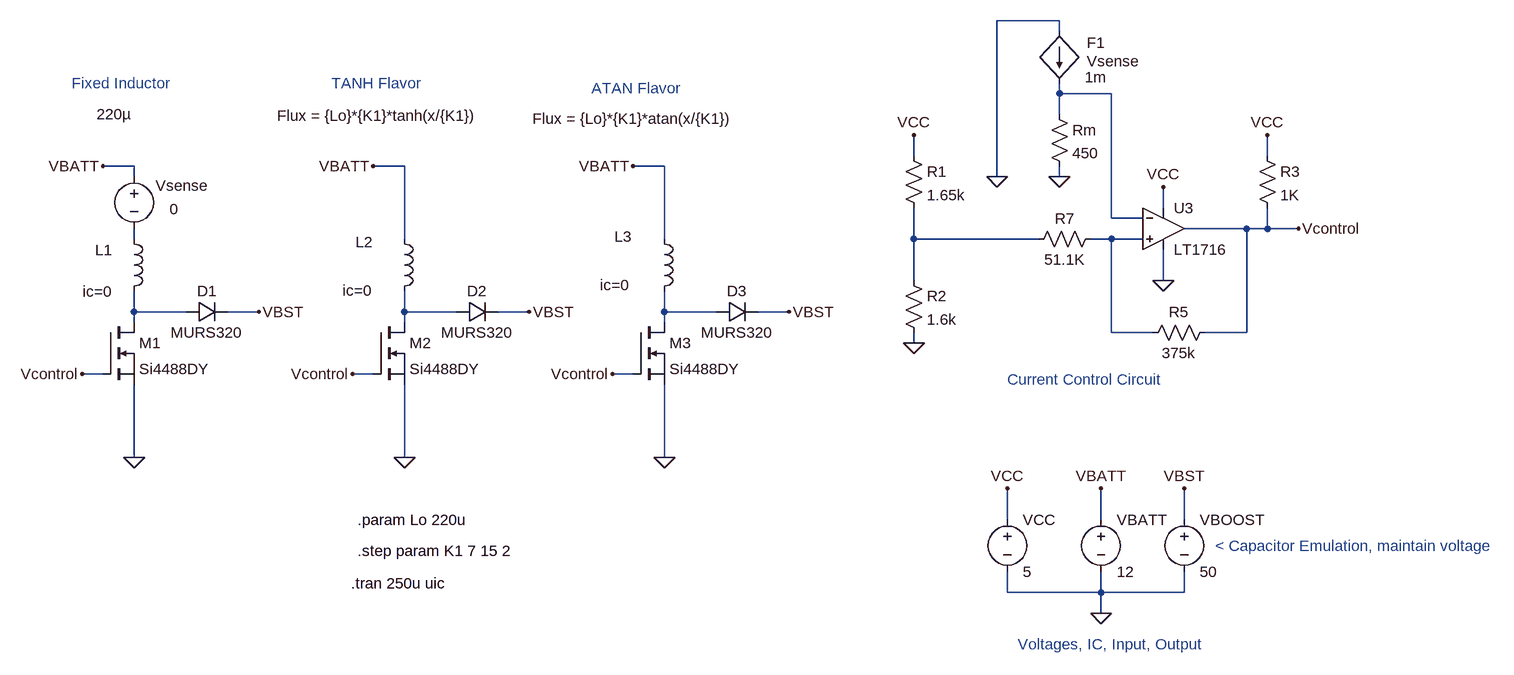
[diagram p0: schematic Nonlinear_L_experiment.asc]
Nonlinear_L_experiment.asc, the LTspice schematic file:
Version 4
SHEET 1 1996 852
WIRE -288 160 -320 160
WIRE -240 -160 -288 -160
WIRE -240 -144 -240 -160
WIRE -240 -48 -240 -64
WIRE -240 64 -240 32
WIRE -240 80 -240 64
WIRE -240 288 -240 176
WIRE -160 64 -240 64
WIRE -48 64 -96 64
WIRE 128 160 96 160
WIRE 176 -160 128 -160
WIRE 176 -48 176 -160
WIRE 176 64 176 32
WIRE 176 80 176 64
WIRE 176 288 176 176
WIRE 256 64 176 64
WIRE 368 64 320 64
WIRE 528 160 496 160
WIRE 576 -160 528 -160
WIRE 576 -48 576 -160
WIRE 576 64 576 32
WIRE 576 80 576 64
WIRE 576 288 576 176
WIRE 656 64 576 64
WIRE 768 64 720 64
WIRE 960 -176 960 -208
WIRE 960 -48 960 -96
WIRE 960 16 960 -48
WIRE 960 112 960 96
WIRE 1088 -144 1088 -384
WIRE 1104 384 1104 336
WIRE 1104 496 1104 464
WIRE 1152 -48 960 -48
WIRE 1184 -384 1088 -384
WIRE 1184 -368 1184 -384
WIRE 1184 -272 1184 -288
WIRE 1184 -240 1184 -272
WIRE 1184 -144 1184 -160
WIRE 1248 384 1248 336
WIRE 1248 496 1104 496
WIRE 1248 496 1248 464
WIRE 1248 528 1248 496
WIRE 1264 -272 1184 -272
WIRE 1264 -80 1264 -272
WIRE 1264 -48 1232 -48
WIRE 1264 96 1264 -48
WIRE 1312 -80 1264 -80
WIRE 1312 -48 1264 -48
WIRE 1328 96 1264 96
WIRE 1344 -96 1344 -128
WIRE 1344 16 1344 -32
WIRE 1376 384 1376 336
WIRE 1376 496 1248 496
WIRE 1376 496 1376 464
WIRE 1472 -64 1376 -64
WIRE 1472 96 1408 96
WIRE 1472 96 1472 -64
WIRE 1504 -176 1504 -208
WIRE 1504 -64 1472 -64
WIRE 1504 -64 1504 -96
WIRE 1552 -64 1504 -64
FLAG 1248 528 0
FLAG -240 288 0
FLAG 1184 -144 0
FLAG 1088 -144 0
FLAG -288 -160 VBATT
FLAG 1248 336 VBATT
FLAG 1104 336 VCC
FLAG 1344 -128 VCC
FLAG 960 -208 VCC
FLAG 1344 16 0
FLAG 1504 -208 VCC
FLAG 1552 -64 Vcontrol
FLAG -320 160 Vcontrol
FLAG 960 112 0
FLAG 176 288 0
FLAG 128 -160 VBATT
FLAG 96 160 Vcontrol
FLAG 368 64 VBST
FLAG 576 288 0
FLAG 528 -160 VBATT
FLAG 496 160 Vcontrol
FLAG 768 64 VBST
FLAG 1376 336 VBST
FLAG -48 64 VBST
SYMBOL voltage 1248 368 R0
WINDOW 123 0 0 Left 0
WINDOW 39 0 0 Left 0
SYMATTR InstName VBATT
SYMATTR Value 12
SYMBOL res 1168 -256 R0
SYMATTR InstName Rm
SYMATTR Value 450
SYMBOL f 1184 -368 R0
WINDOW 0 42 18 Left 0
WINDOW 3 42 46 Left 0
WINDOW 123 39 71 Left 0
SYMATTR InstName F1
SYMATTR Value Vsense
SYMATTR Value2 1m
SYMBOL voltage -240 -160 R0
WINDOW 0 33 30 Left 0
WINDOW 3 55 66 Left 0
SYMATTR InstName Vsense
SYMATTR Value 0
SYMBOL diode -160 80 R270
WINDOW 0 32 32 VTop 0
WINDOW 3 0 32 VBottom 0
SYMATTR InstName D1
SYMATTR Value MURS320
SYMBOL res 944 -192 R0
SYMATTR InstName R1
SYMATTR Value 1.65k
SYMBOL res 944 0 R0
SYMATTR InstName R2
SYMATTR Value 1.6k
SYMBOL res 1488 -192 R0
SYMATTR InstName R3
SYMATTR Value 1K
SYMBOL res 1424 80 R90
WINDOW 0 0 56 VBottom 0
WINDOW 3 32 56 VTop 0
SYMATTR InstName R5
SYMATTR Value 375k
SYMBOL voltage 1104 368 R0
WINDOW 123 0 0 Left 0
WINDOW 39 0 0 Left 0
SYMATTR InstName VCC
SYMATTR Value 5
SYMBOL res 1248 -64 R90
WINDOW 0 0 56 VBottom 0
WINDOW 3 32 56 VTop 0
SYMATTR InstName R7
SYMATTR Value 51.1K
SYMBOL Comparators\\LT1716 1344 -64 R0
SYMATTR InstName U3
SYMBOL ind -256 -64 R0
WINDOW 0 -44 33 Left 0
WINDOW 3 -42 -176 Left 0
WINDOW 39 -63 97 Left 0
SYMATTR InstName L1
SYMATTR Value 220µ
SYMATTR SpiceLine ic=0
SYMBOL voltage 1376 368 R0
WINDOW 123 0 0 Left 0
WINDOW 39 0 0 Left 0
SYMATTR InstName VBOOST
SYMATTR Value 50
SYMBOL diode 256 80 R270
WINDOW 0 32 32 VTop 0
WINDOW 3 0 32 VBottom 0
SYMATTR InstName D2
SYMATTR Value MURS320
SYMBOL nmos -288 80 R0
SYMATTR InstName M1
SYMATTR Value Si4488DY
SYMBOL nmos 128 80 R0
SYMATTR InstName M2
SYMATTR Value Si4488DY
SYMBOL ind 160 -64 R0
WINDOW 0 -59 21 Left 0
WINDOW 3 -180 -174 Left 0
WINDOW 39 -79 95 Left 0
SYMATTR InstName L2
SYMATTR Value Flux = {Lo}*{K1}*tanh(x/{K1})
SYMATTR SpiceLine ic=0
SYMBOL diode 656 80 R270
WINDOW 0 32 32 VTop 0
WINDOW 3 0 32 VBottom 0
SYMATTR InstName D3
SYMATTR Value MURS320
SYMBOL nmos 528 80 R0
SYMATTR InstName M3
SYMATTR Value Si4488DY
SYMBOL ind 560 -64 R0
WINDOW 0 -61 12 Left 0
WINDOW 3 -187 -169 Left 0
WINDOW 39 -83 87 Left 0
SYMATTR InstName L3
SYMATTR Value Flux = {Lo}*{K1}*atan(x/{K1})
SYMATTR SpiceLine ic=0
TEXT 94 482 Left 0 !.tran 250u uic
TEXT 104 432 Left 0 !.step param K1 7 15 2
TEXT 104 384 Left 0 !.param Lo 220u
TEXT 1104 168 Left 0 ;Current Control Circuit
TEXT 464 -280 Left 0 ;ATAN Flavor
TEXT 64 -288 Left 0 ;TANH Flavor
TEXT -336 -288 Left 0 ;Fixed Inductor
TEXT 1424 424 Left 0 ;< Capacitor Emulation, maintain voltage
TEXT 1120 576 Left 0 ;Voltages, IC, Input, Output

The netlist it stands for:
* Nonlinear_L_experiment.asc
VBATT VBATT 0 12
Rm N006 0 450
F1 0 N006 Vsense 1m
Vsense VBATT N001 0
D1 N002 VBST MURS320
R1 VCC N005 1.65k
R2 N005 0 1.6k
R3 VCC Vcontrol 1K
R5 Vcontrol N007 375k
VCC VCC 0 5
R7 N007 N005 51.1K
XU3 N007 N006 VCC 0 Vcontrol LT1716  ; pins In+ In- V+ V- OUT
L1 N001 N002 220µ ic=0
VBOOST VBST 0 50
D2 N003 VBST MURS320
M1 N002 Vcontrol 0 0 Si4488DY
M2 N003 Vcontrol 0 0 Si4488DY
L2 VBATT N003 Flux = {Lo}*{K1}*tanh(x/{K1}) ic=0
D3 N004 VBST MURS320
M3 N004 Vcontrol 0 0 Si4488DY
L3 VBATT N004 Flux = {Lo}*{K1}*atan(x/{K1}) ic=0
.model D D
.lib standard.dio
.model NMOS NMOS
.model PMOS PMOS
.lib standard.mos
.tran 250u uic
.step param K1 7 15 2
.param Lo 220u
* Current Control Circuit
* ATAN Flavor
* TANH Flavor
* Fixed Inductor
* < Capacitor Emulation, maintain voltage
* Voltages, IC, Input, Output
.lib LTC1.lib
.backanno
.end